# EAGLE design Project_MS4 (EAGLE 9.3.0)
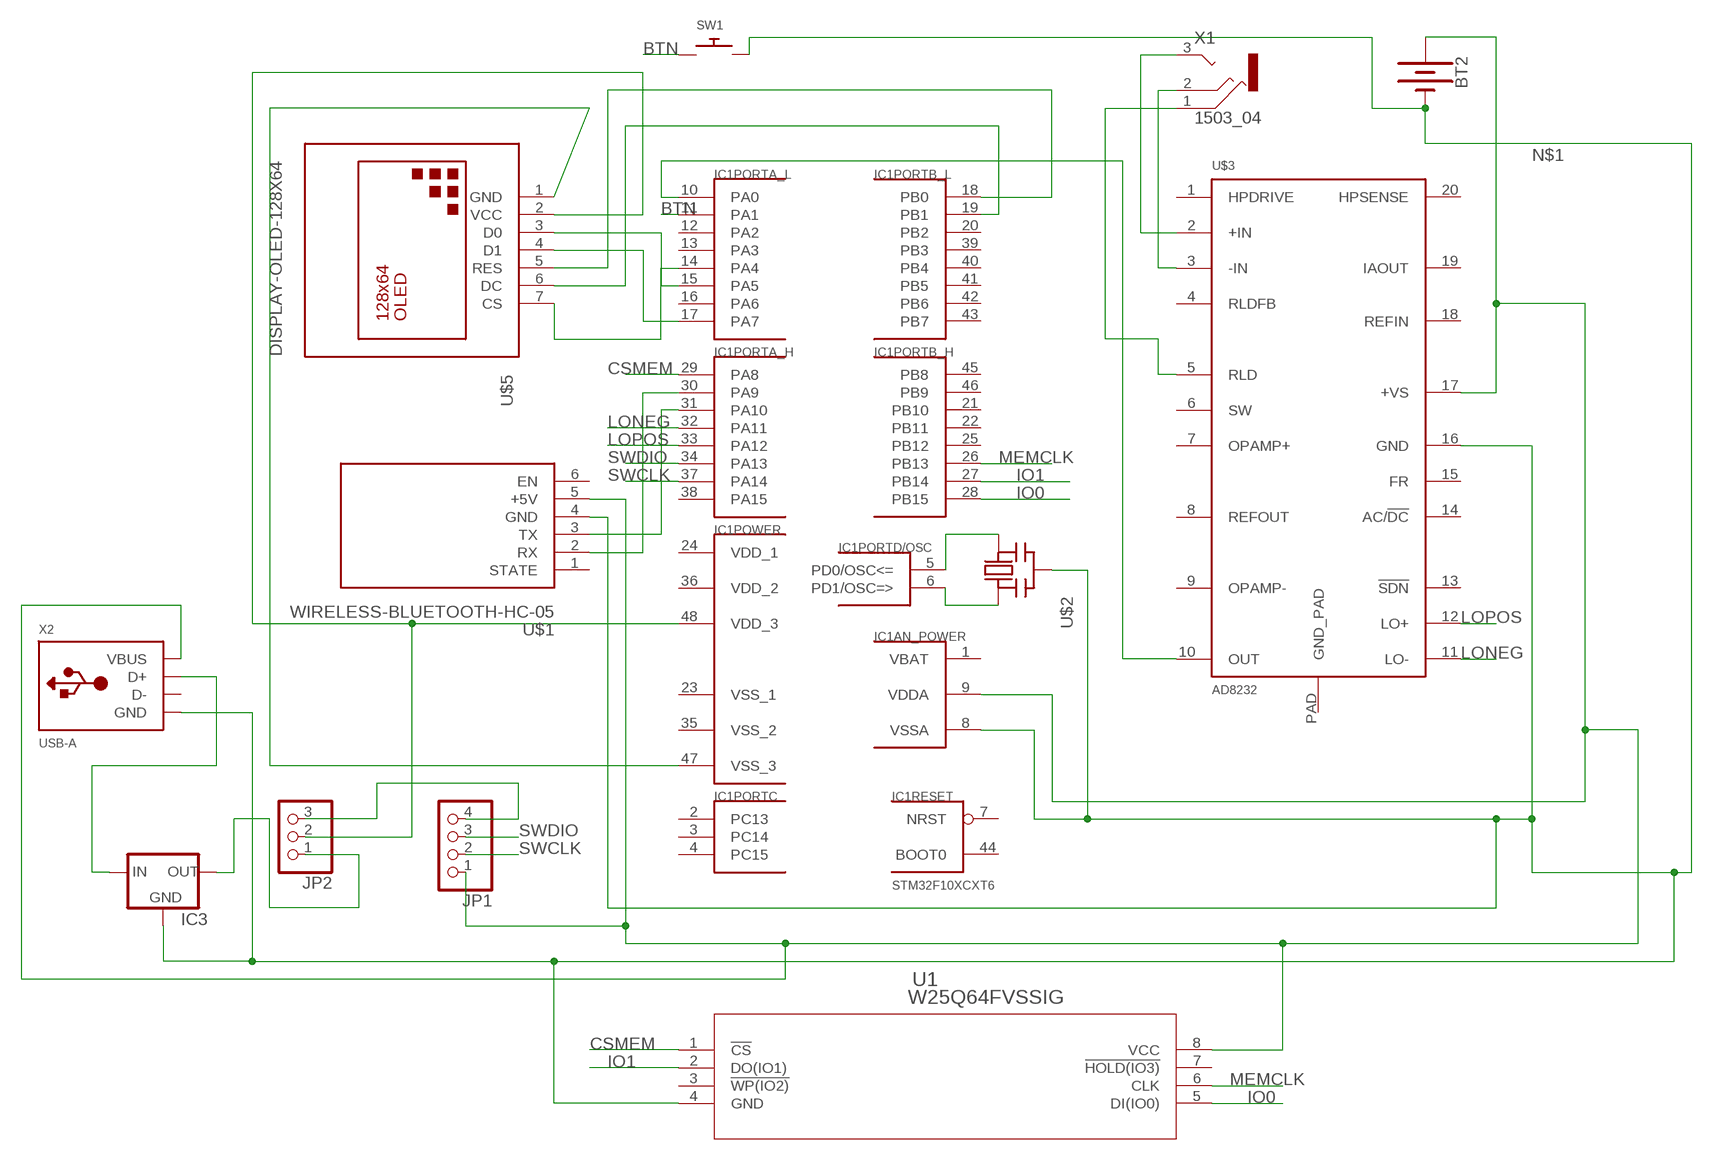
[diagram p0: schematic, sheet 1]

## Parts
BT2  BATTERY-AAA_KIT  [BATTERY-AAA-KIT]
IC1  STM32F10XCXT6  [TQFP48]
IC3  MCP1700INLINE  [TO92-INLINE]
JP1  PINHD-1X4  [1X04]
JP2  PINHD-1X3  [1X03]
SW1  SWITCH_PUSHBUTTONC&K_KSS  [BTN_CK_KSS]
U1  W25Q64FVSSIG  [WIN_SS-8]
U$1  WIRELESS-BLUETOOTH-HC-05  [WIRELESS-BLUETOOTH-HC-05]
U$2  CERMOSCILL-AWCSR  [AWCSR]
U$3  AD8232  [LFCSP_20]
U$5  DISPLAY-OLED-128X64  [DISPLAY-OLED-128X64]
X1  1503_04  [1503_04]
X2  USB-A  [MOLEX_480371000]

## Nets
BTN: IC1.11(PORTA_L:PA1) SW1.P$1
CSMEM: IC1.29(PORTA_H:PA8) U1.1(!CS)
IO0: IC1.28(PORTB_H:PB15) U1.5(DI(IO0))
IO1: IC1.27(PORTB_H:PB14) U1.2(DO(IO1))
LONEG: IC1.32(PORTA_H:PA11) U$3.11(LO-)
LOPOS: IC1.33(PORTA_H:PA12) U$3.12(LO+)
MEMCLK: IC1.26(PORTB_H:PB13) U1.6(CLK)
N$1: BT2.PWR@1(+) IC1.9(AN_POWER:VDDA) JP1.1 U1.8(VCC) U$1.5(+5V) U$3.17(+VS) X2.1(VBUS)
N$3: IC1.10(PORTA_L:PA0) U$3.10(OUT)
N$4: IC1.19(PORTB_L:PB1) U$5.6(DC)
N$5: IC1.14(PORTA_L:PA4) U$5.7(CS)
N$6: IC1.17(PORTA_L:PA7) U$5.4(D1)
N$7: IC1.15(PORTA_L:PA5) U$5.3(D0)
N$8: IC1.47(POWER:VSS_3) U$5.1(GND)
N$9: JP1.4 JP2.3
N$10: IC1.48(POWER:VDD_3) JP2.2 U$5.2(VCC)
N$11: IC3.3(OUT) JP2.1
N$12: U$3.5(RLD) X1.1
N$13: U$3.3(-IN) X1.2
N$14: IC1.18(PORTB_L:PB0) U$5.5(RES)
N$15: U$3.2(+IN) X1.3
N$16: IC3.2(IN) X2.3(D+)
N$18: IC1.6(PORTD/OSC:PD1/OSC=>) U$2.1(IN)
N$19: IC1.5(PORTD/OSC:PD0/OSC<=) U$2.3(OUT)
N$20: IC1.30(PORTA_H:PA9) U$1.2(RX)
N$21: IC1.31(PORTA_H:PA10) U$1.3(TX)
N$31: BT2.GND@1(-) IC1.8(AN_POWER:VSSA) IC3.1(GND) SW1.P$2 U1.4(GND) U$1.4(GND) U$2.2(GND) U$3.16(GND) X2.4(GND)
SWCLK: IC1.37(PORTA_H:PA14) JP1.2
SWDIO: IC1.34(PORTA_H:PA13) JP1.3
Unconnected: IC1.2(PORTC:PC13) IC1.3(PORTC:PC14) IC1.4(PORTC:PC15) IC1.7(RESET:NRST) IC1.12(PORTA_L:PA2) IC1.13(PORTA_L:PA3) IC1.16(PORTA_L:PA6) IC1.20(PORTB_L:PB2) IC1.21(PORTB_H:PB10) IC1.22(PORTB_H:PB11) IC1.25(PORTB_H:PB12) IC1.38(PORTA_H:PA15) IC1.39(PORTB_L:PB3) IC1.40(PORTB_L:PB4) IC1.41(PORTB_L:PB5) IC1.42(PORTB_L:PB6) IC1.43(PORTB_L:PB7) IC1.44(RESET:BOOT0) IC1.45(PORTB_H:PB8) IC1.46(PORTB_H:PB9) U1.3(!WP(IO2)) U1.7(!HOLD(IO3)) U$1.1(STATE) U$1.6(EN) U$3.1(HPDRIVE) U$3.4(RLDFB) U$3.6(SW) U$3.7(OPAMP+) U$3.8(REFOUT) U$3.9(OPAMP-) U$3.13(!SDN) U$3.14(AC/!DC) U$3.15(FR) U$3.18(REFIN) U$3.19(IAOUT) U$3.20(HPSENSE) U$3.PAD(GND_PAD) X2.2(D-)

## Power pins joined to a net without a drawn wire
VBAT: IC1.1(AN_POWER:VBAT)
VDD_1: IC1.24(POWER:VDD_1)
VDD_2: IC1.36(POWER:VDD_2)
VSS_1: IC1.23(POWER:VSS_1)
VSS_2: IC1.35(POWER:VSS_2)

## Library data of the parts
BT2 = SparkFun-Batteries:BATTERY: Battery - Single Cell A variety of battery chemistries, sizes, and footprints. Device List: 20MM_PTH - Coin Cell Battery Holder - 20mm (PTH) <https://www.sparkfun.com/products/783> 20MM_PTH_KIT- Coin Cell battery Holder - 20 mm (PTH) <http://www.sparkfun.com/products/783>kit version with special mask 6.8MM_PTH - Coin Cell Battery Holder - 6.8MM(SMD) <https://www.digikey.com/product-detail/en/seiko-instruments/MS621FE-FL11E/728-1057-ND/1889208?WT.srch=1&gclid=CNOQ5a6LzdQCFZS2wAodXCkE0g> 12MM_SMD - Coin Cell Battery Holder - 12mm (SMD) <https://www.sparkfun.com/products/10592> 12MM_PTH - Coin Cell Battery Holder - 12mm (PTH) <https://www.sparkfun.com/products/7948> 20MM_SMD - 20mm Coin Cell Battery Holder (SMD) (2 legs) Used on the Big Time Watch Kit <https://www.sparkfun.com/products/11734> 20MM_SMD_4LEGS - Coin Cell Battery Holder - 20mm (SMD) <https://www.sparkfun.com/products/11892> 20MM_SMD_4LEGS_OVERPASTE - Coin Cell Battery Holder - 20mm (SMD) <https://www.sparkfun.com/products/11892> (Over-paste on the legs) 24.5MM_PTH - Coin Cell Battery Holder - 24.5mm (PTH) <https://www.sparkfun.com/products/8863> 9V - 9V Battery Holder - PC Mount Used on the SparkFun SparkPunk Sound Kit <https://www.sparkfun.com/products/11177> and SparkFun SparkPunk Sequencer Kit <https://www.sparkfun.com/products/12707> 18650 - Battery Holder - 18650 (PTH) <https://www.sparkfun.com/products/13113> AA - Battery Holder - 1xAA (PTH) <https://www.sparkfun.com/products/7949> AAA - Battery Holder - 1xAAA (PTH) <https://www.sparkfun.com/products/12718> AA_KIT - Battery Holder - 1xAA (PTH) <https://www.sparkfun.com/products/7949> Special kit package - pads only have exposed copper on one side of the board. AAA_KIT - Battery Holder - 1xAAA (PTH) <https://www.sparkfun.com/products/12718> Special kit package - pads only have exposed copper on one side of the board.; PROD_ID: BATT-08571; SF_SKU: PRT-12718
IC1 = stm32:STM32F10XCXT6: ST STM32F101/103 48pin LQFP
IC3 = adafruit:MCP1700: VOLTAGE REGULATOR
JP1 = pinhead:PINHD-1X4: PIN HEADER
JP2 = pinhead:PINHD-1X3: PIN HEADER
SW1 = adafruit:SWITCH_PUSHBUTTON: Buttons SOFTTOUCHSMD_SJ - Soft touch temporary push button (Super Junk Akihabara) Compatible with SKPMANE010 [Mouser: 688-SKPMAN] C&K_KSS = Digikey: KSS221GLFS
U1 = winbond_mem:W25Q64FVSSIG; MANUFACTURER_PART_NUMBER: W25Q64FVSSIG; VENDOR: Winbond
U$1 = diy-modules:WIRELESS-BLUETOOTH-HC-05: Bluetooth Transceiver Module based on HC-05 board Tutorial is available here: https://arduino-info.wikispaces.com/BlueTooth-HC05-HC06-Modules-How-To Click here to find device on ebay.com <http://www.ebay.com/sch/hc-05+module+rs232>
U$2 = adafruit:CERMOSCILL: Ceramic oscillator with built in capacitors such as ZTT-12MHz http://www.ladyada.net/library/eagle
U$3 = AD8232:AD8232; AVAILABILITY: Unavailable; DESCRIPTION: ADI ECG and HRM IC Single Lead; MF: Analog Devices; MP: AD8232; PACKAGE: None; PRICE: None
U$5 = diy-modules:DISPLAY-OLED-128X64: 128x64 Dot Matrix OLED Module based on SSD1306 chip Variant with SPI interface More details available here: http://www.instructables.com/id/How-to-use-OLED-display-arduino-module/ SSD1306 datasheet: https://cdn-shop.adafruit.com/datasheets/SSD1306.pdf Click here to find device on ebay.com <http://www.ebay.com/sch/oled+display+128x64> Note: There are two variants: I2C and SPI. Search for the proper version.
X1 = con-lumberg:1503_04: Jack connectors according to JISC 6560, 3.5 mm, IP 57 Klinkensteckverbinder nach JISC 6560, 3,5 mm, IP 57 Source: http://www.lumberg.com/Produkte/PDFs/1503_04.pdf; OC_FARNELL: 1216981; OC_NEWARK: unknown
X2 = adafruit:USB-A: USB type A 'plug' Used for things that can directly connect to a USB port, say USB key

## Board
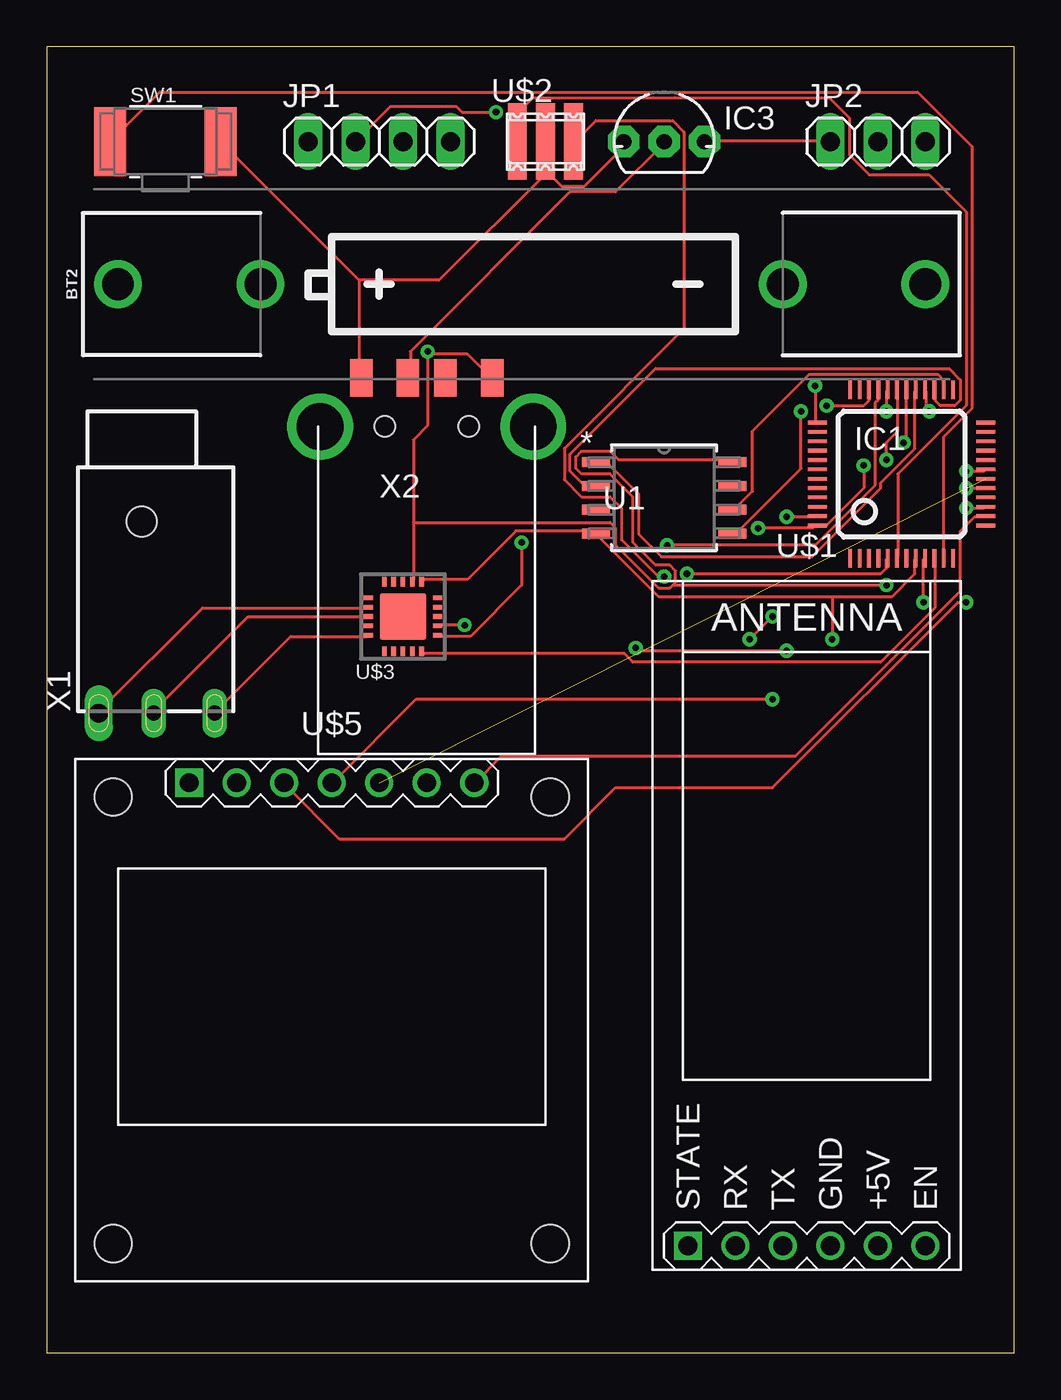
[diagram p1: board, top side]
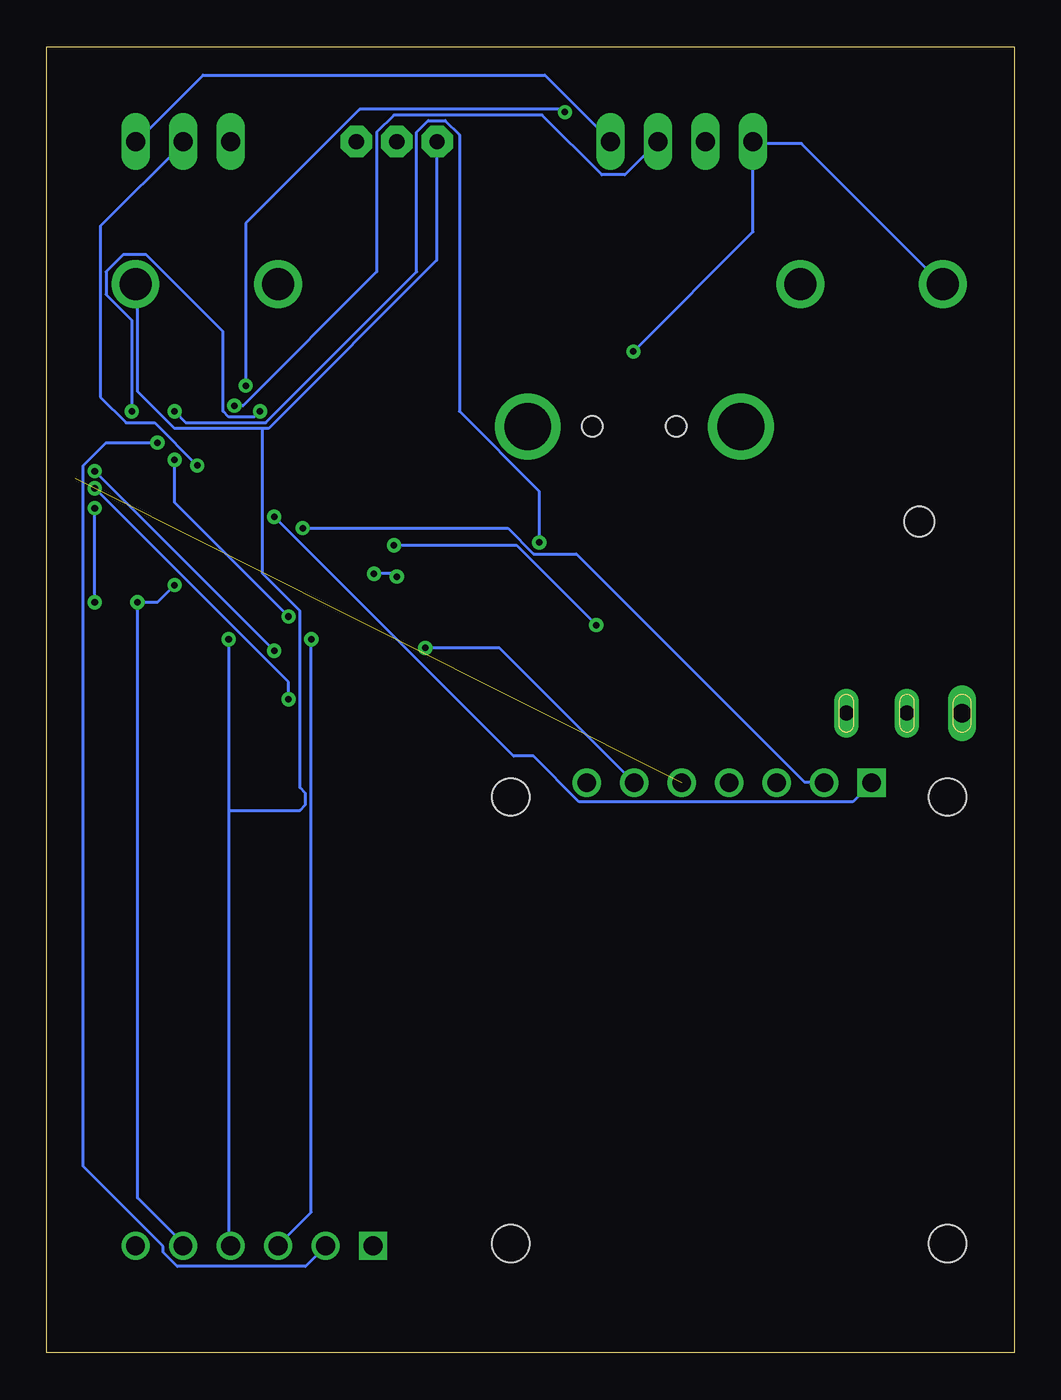
[diagram p2: board, bottom side, seen from below]

Size 51.74 x 69.84 mm. Coordinates in mm from the lower left corner, seen from the top.
Outline: 0,0 51.74,0 51.74,69.84 0,69.84 0,0
Copper layers (1*16): Top 0.035mm / dielectric 1.5mm / Bottom 0.035mm
Design rules "default": minimum track width 6mil, minimum drill 0.35mm, track to track 6mil, track to pad 6mil, pad to pad 6mil, via to via 6mil, smd to smd 6mil, copper to edge 40mil, drill to drill 6mil, minimum pad ring 10mil, minimum via ring 8mil, stop-mask expansion 4mil, vias tented up to drill 0mil, thermal gap 10mil

### Footprints (pad centres in the part's own frame; a part is rotated, then mirrored left to right if it is on the bottom)
BATTERY-AAA-KIT = drill 1.702: GND@1 21.59,0; GND@2 13.97,0; PWR@1 -21.59,0; PWR@2 -13.97,0
TQFP48 = smd 0.2 x 1: 1 -2.75,-4.5; 2 -2.25,-4.5; 3 -1.75,-4.5; 4 -1.25,-4.5; 5 -0.75,-4.5; 6 -0.25,-4.5; 7 0.25,-4.5; 8 0.75,-4.5; 9 1.25,-4.5; 10 1.75,-4.5; 11 2.25,-4.5; 12 2.75,-4.5; 25 2.75,4.5; 26 2.25,4.5; 27 1.75,4.5; 28 1.25,4.5; 29 0.75,4.5; 30 0.25,4.5; 31 -0.25,4.5; 32 -0.75,4.5; 33 -1.25,4.5; 34 -1.75,4.5; 35 -2.25,4.5; 36 -2.75,4.5 | smd 1 x 0.2: 13 4.5,-2.75; 14 4.5,-2.25; 15 4.5,-1.75; 16 4.5,-1.25; 17 4.5,-0.75; 18 4.5,-0.25; 19 4.5,0.25; 20 4.5,0.75; 21 4.5,1.25; 22 4.5,1.75; 23 4.5,2.25; 24 4.5,2.75; 37 -4.5,2.75; 38 -4.5,2.25; 39 -4.5,1.75; 40 -4.5,1.25; 41 -4.5,0.75; 42 -4.5,0.25; 43 -4.5,-0.25; 44 -4.5,-0.75; 45 -4.5,-1.25; 46 -4.5,-1.75; 47 -4.5,-2.25; 48 -4.5,-2.75
TO92-INLINE = drill 0.813 pad 1.676 octagon: 1 -2.159,0; 2 0,0; 3 2.159,0
1X04 = drill 1.016 long: 1 -3.81,0; 2 -1.27,0; 3 1.27,0; 4 3.81,0
1X03 = drill 1.016 long: 1 -2.54,0; 2 0,0; 3 2.54,0
BTN_CK_KSS = smd 1.7 x 3.7: P$1 -2.95,0; P$2 2.95,0
WIN_SS-8 = smd 1.499 x 0.533: 1 -3.658,1.905; 2 -3.658,0.635; 3 -3.658,-0.635; 4 -3.658,-1.905; 5 3.658,-1.905; 6 3.658,-0.635; 7 3.658,0.635; 8 3.658,1.905
WIRELESS-BLUETOOTH-HC-05 = drill 1 square: 1 -6.35,-17.145 | drill 1: 2 -3.81,-17.145; 3 -1.27,-17.145; 4 1.27,-17.145; 5 3.81,-17.145; 6 6.35,-17.145
AWCSR = smd 1 x 4.1: 1 -1.5,0; 2 0,0; 3 1.5,0
LFCSP_20 = smd 0.5 x 0.25: 1 -1.85,1; 2 -1.85,0.5; 3 -1.85,0; 4 -1.85,-0.5; 5 -1.85,-1; 11 1.85,-1; 12 1.85,-0.5; 13 1.85,0; 14 1.85,0.5; 15 1.85,1 | smd 0.25 x 0.5: 6 -1,-1.85; 7 -0.5,-1.85; 8 0,-1.85; 9 0.5,-1.85; 10 1,-1.85; 16 1,1.85; 17 0.5,1.85; 18 0,1.85; 19 -0.5,1.85; 20 -1,1.85 | smd 2.5 x 2.5: PAD 0,0
DISPLAY-OLED-128X64 = drill 1 square: 1 -7.62,12.7 | drill 1: 2 -5.08,12.7; 3 -2.54,12.7; 4 0,12.7; 5 2.54,12.7; 6 5.08,12.7; 7 7.62,12.7 | hole 2: -11.684,11.938; 11.684,11.938; 11.684,-11.938; -11.684,-11.938
1503_04 = drill 0.8 pad 1.2 long: 1 3.9,-10.25; 2 0.65,-10.25 | drill 1 pad 1.2 long: 3 -2.3,-10.25 | hole 1.6: 0,0
MOLEX_480371000 = smd 1.2 x 2: 1 3.5,2.6; 2 1,2.6; 3 -1,2.6; 4 -3.5,2.6 | drill 2.5: M1 -5.7,0; M2 5.7,0 | hole 1.1: -2.25,0; 2.25,0

### Placement (x,y rotation side)
BT2  25.4,57.15 0 top
IC1  45.72,46.99 0 top
IC3  33.02,64.77 0 top
JP1  17.78,64.77 0 top
JP2  44.45,64.77 0 top
SW1  6.35,64.77 0 top
U1  33.02,45.72 0 top
U$1  40.64,22.86 0 top
U$2  26.67,64.77 0 top
U$3  19.05,39.37 0 top
U$5  15.24,17.78 0 top
X1  5.08,44.45 0 top
X2  20.32,49.53 0 top

### Tracks (layer width: path | path; a pad name or v marks a point on that pad's centre or on a via)
BTN
  Top 0.152: IC1.11 47.95,42.57 47.95,48.97 49.48,50.5 49.48,64.52 46.58,67.41 6.04,67.41 3.45,64.82 SW1.P$1
CSMEM
  Top 0.152: IC1.29 46.43,51.41 46.43,48.36 44.6,46.53 44.6,46.23 40.95,42.57 32.87,42.57 31.65,43.79 31.65,45.92 29.97,47.6 29.36,47.6 U1.1
IO0  (via drill 0.35)
  Top 0.152: v47.19,50.34 47.04,50.5 47.04,51.41 IC1.28 | v40.34,50.34 40.34,47.3 36.98,43.94 36.68,43.94 U1.5
  Bottom 0.152: v47.19,50.34 47.19,55.22 48.56,56.59 48.56,57.81 47.65,58.73 46.43,58.73 42.32,54.61 42.32,50.34 42.01,50.04 40.64,50.04 v40.34,50.34
IO1
  Top 0.152: IC1.27 47.5,51.41 47.5,50.95 47.8,50.65 48.56,50.65 48.87,50.95 48.87,52.02 48.26,52.63 32.56,52.63 27.99,48.06 27.99,47.14 28.75,46.38 29.36,46.38 U1.2
LONEG  (via drill 0.35)
  Top 0.152: v25.4,43.33 25.4,41.05 22.66,38.3 20.98,38.3 U$3.11 | v44.91,50.34 44.91,51.41 IC1.32
  Bottom 0.152: v25.4,43.33 25.4,46.08 29.67,50.34 29.67,65.13 30.43,65.89 31.34,65.89 31.95,65.28 31.95,57.81 40.03,49.73 44.3,49.73 v44.91,50.34
LOPOS  (via drill 0.35)
  Top 0.152: v22.35,38.91 20.98,38.91 U$3.12 | v33.17,43.18 41.1,43.18 44.3,46.38 44.3,50.8 44.45,50.95 44.45,51.41 IC1.33
  Bottom 0.152: v22.35,38.91 26.62,43.18 v33.17,43.18
MEMCLK
  Top 0.152: IC1.26 47.95,51.56 47.95,52.02 47.65,52.32 40.79,52.32 37.74,49.28 37.74,46.08 36.68,45.01 U1.6
N$1  (via drill 0.35)
  Top 0.152: v46.89,40.13 46.89,42.42 IC1.9 | 19.61,44.4 19.61,48.82 20.37,49.58 20.37,53.24 20.52,53.39 | 19.61,44.4 19.61,41.35 U$3.17 | 20.52,53.39 22.5,53.39 23.72,52.17 X2.1 | 33.48,41.05 33.33,40.89 32.71,40.89 30.43,43.18 30.43,44.09 30.12,44.4 19.61,44.4 | 33.48,41.05 33.63,41.2 33.63,41.81 33.33,42.11 32.56,42.11 31.34,43.33 31.34,45.77 30.12,46.99 28.6,46.99 28.3,47.3 28.3,47.9 28.6,48.21 30.12,48.21 30.58,47.75 36.68,47.75 U1.8 | 20.52,53.39 v20.37,53.54 | 33.48,41.05 v44.91,41.05
  Bottom 0.152: U$1.5 44.45,5.84 46.89,8.28 v46.89,40.13 45.82,40.13 v44.91,41.05 | 13.97,64.67 11.38,64.67 3.91,57.2 BT2.PWR@1 | 13.97,64.67 13.97,59.94 v20.37,53.54 | 13.97,64.67 JP1.1
N$3
  Top 0.152: U$3.10 20.07,37.39 30.89,37.39 31.34,36.93 44.6,36.93 47.5,39.83 47.5,42.42 IC1.10
N$4  (via drill 0.35)
  Top 0.152: v49.17,47.14 50.09,47.14 IC1.19 | v39.57,37.54 31.65,37.54 v31.5,37.69
  Bottom 0.152: v39.57,37.54 v49.17,47.14 | v31.5,37.69 27.53,37.69 U$5.6
N$5
  Top 0.152: IC1.14 50.09,44.7 49.63,44.7 48.87,43.94 48.87,40.74 40.03,31.9 24.33,31.9 22.96,30.53 U$5.7
N$6  (via drill 0.35)
  Top 0.152: v49.17,46.23 50.09,46.23 IC1.17 | v38.81,34.95 19.76,34.95 15.34,30.53 U$5.4
  Bottom 0.152: v49.17,46.23 38.81,35.87 v38.81,34.95
N$7  (via drill 0.35)
  Top 0.152: v49.17,45.16 50.09,45.16 IC1.15 | v49.17,40.13 48.72,40.13 38.81,30.23 30.43,30.23 27.69,27.48 15.65,27.48 12.75,30.38 U$5.3
  Bottom 0.152: v49.17,40.13 v49.17,45.16
N$8  (via drill 0.35)
  Top 0.152: v39.57,44.7 41.1,44.7 IC1.47
  Bottom 0.152: v39.57,44.7 26.77,31.9 25.7,31.9 23.27,29.46 8.64,29.46 U$5.1
N$9
  Bottom 0.152: JP1.4 21.59,64.82 25.09,68.33 43.38,68.33 46.89,64.82 JP2.3
N$10  (via drill 0.35)
  Top 0.152: v43.69,47.45 43.69,46.23 41.71,44.25 41.25,44.25 IC1.48 41.1,44.25 40.95,44.09 v38.05,44.09
  Bottom 0.152: v43.69,47.45 45.97,49.73 47.5,49.73 48.87,51.11 48.87,60.25 44.45,64.67 JP2.2 | v38.05,44.09 27.08,44.09 25.7,42.72 23.42,42.72 11.23,30.53 10.16,30.53 U$5.2
N$11
  Top 0.152: JP2.1 41.86,64.82 35.31,64.82 IC3.3
N$12
  Top 0.152: U$3.5 17.17,38.3 13.06,38.3 9.09,34.34 X1.1
N$13
  Top 0.152: U$3.3 10.77,39.37 5.74,34.34 X1.2
N$14  (1 unrouted)
N$15
  Top 0.152: U$3.2 17.17,39.83 8.33,39.83 2.84,34.34 X1.3
N$16
  Top 0.152: X2.3 19.46,52.17 19.46,53.54 27.99,62.08 30.43,62.08 33.02,64.67 IC3.2
N$18
  Top 0.152: IC1.6 45.52,42.57 45.52,46.99 49.17,50.65 49.17,61.01 47.19,62.99 43.99,62.99 42.93,64.06 42.93,66.04 41.86,67.11 26.01,67.11 25.25,66.34 25.25,64.82 U$2.1
N$19  (via drill 0.35)
  Top 0.152: v34.24,41.66 44.6,41.66 44.91,41.96 44.91,42.42 IC1.5 | v33.02,41.5 32.71,41.5 30.73,43.49 30.73,45.16 30.12,45.77 28.6,45.77 27.69,46.69 27.69,48.36 34.09,54.76 34.09,65.28 33.48,65.89 29.36,65.89 28.3,64.82 U$2.3
  Bottom 0.152: v34.24,41.66 33.17,41.66 v33.02,41.5
N$20  (via drill 0.35)
  Top 0.152: v45.82,48.67 45.97,48.82 45.97,51.41 IC1.30
  Bottom 0.152: v45.82,48.67 48.56,48.67 49.78,47.45 49.78,9.96 45.52,5.69 45.52,5.38 44.76,4.62 37.9,4.62 36.83,5.69 U$1.2
N$21  (via drill 0.35)
  Top 0.152: v44.91,47.75 44.91,48.67 45.52,49.28 45.52,51.41 IC1.31 | v37.59,38.15 v38.81,39.37
  Bottom 0.152: v44.91,47.75 44.91,45.47 v38.81,39.37 | v37.59,38.15 37.59,7.52 39.27,5.84 U$1.3
N$31  (via drill 0.35)
  Top 0.152: 16.71,57.35 16.71,52.17 X2.4 | 16.71,57.35 9.4,64.67 SW1.P$2 | 26.77,63.14 27.53,62.38 28.75,62.38 30.73,64.36 30.73,64.67 IC3.1 | 26.77,63.14 26.77,64.67 U$2.2 26.77,63.14 | 16.71,57.35 20.98,57.35 26.77,63.14 | U$3.16 20.07,41.35 22.5,41.35 25.09,43.94 29.36,43.94 U1.4 29.36,43.79 32.71,40.44 42.01,40.44 | 42.01,40.44 45.21,40.44 46.43,41.66 46.43,42.42 IC1.8 | 42.01,40.44 v42.01,38.15
  Bottom 0.152: 40.18,49.43 39.88,49.43 30.89,58.42 30.89,64.67 IC3.1 | 40.18,49.43 44.91,49.43 46.89,51.41 46.89,57.05 BT2.GND@1 | v42.01,38.15 42.01,29.01 | 42.01,29.01 42.01,5.84 U$1.4 | 40.18,49.43 40.18,41.66 38.2,39.68 38.2,30.23 37.9,29.92 37.9,29.31 38.2,29.01 42.01,29.01
SWCLK  (via drill 0.35)
  Top 0.152: v41.1,51.71 41.1,49.73 IC1.37 | v24.03,66.34 22.2,66.34 21.89,66.65 18.39,66.65 JP1.2
  Bottom 0.152: v41.1,51.71 41.1,60.4 35,66.5 24.18,66.5 v24.03,66.34
SWDIO  (via drill 0.35)
  Top 0.152: v41.71,50.65 43.69,50.65 43.99,50.95 43.99,51.41 IC1.34
  Bottom 0.152: v41.71,50.65 41.25,50.65 34.09,57.81 34.09,65.28 33.17,66.19 25.25,66.19 22.05,62.99 20.83,62.99 JP1.3